# Altium project bt5.PrjPcb
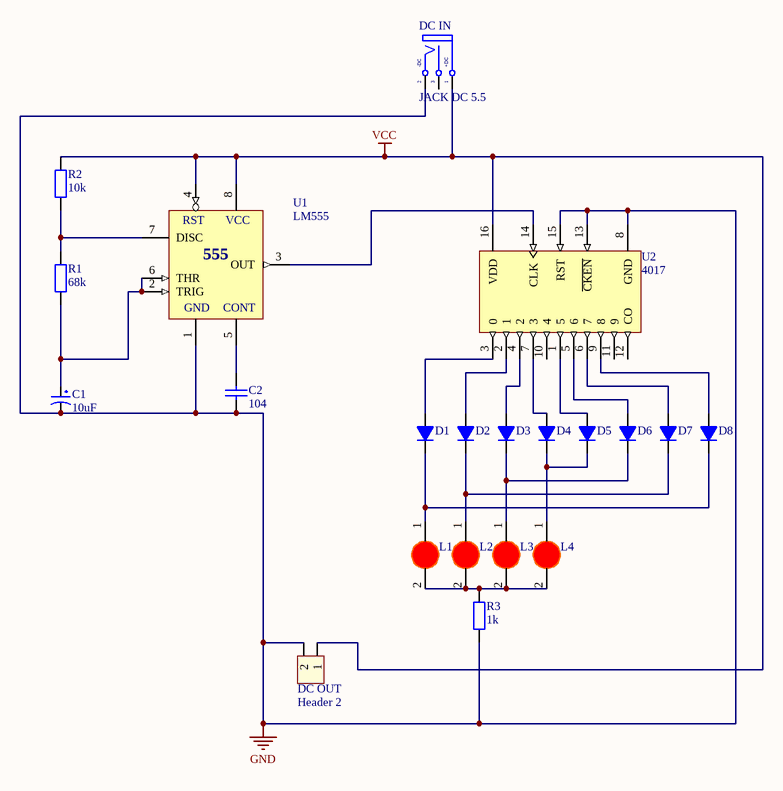
[diagram p0: schematic.SchDoc]
1 sheet, 21 parts. Net scope: global (net labels, ports and power ports of the same name join across sheets).
Board file: PCB.PcbDoc

## Sheet schematic.SchDoc
size A; SheetNumber: 1; SheetTotal: 1

### Parts
C1  10uF  [tu hoa 4mm]
C2  104  [tu gom]
D1  (no value)  [DIODE 1A]
D2  (no value)  [DIODE 1A]
D3  (no value)  [DIODE 1A]
D4  (no value)  [DIODE 1A]
D5  (no value)  [DIODE 1A]
D6  (no value)  [DIODE 1A]
D7  (no value)  [DIODE 1A]
D8  (no value)  [DIODE 1A]
DC_IN  JACK DC 5.5  [JACK DC 5.5]
DC_OUT  Header 2  [HED2]
L1  (no value)  [LED-3MM-RED]
L2  (no value)  [LED-3MM-RED]
L3  (no value)  [LED-3MM-RED]
L4  (no value)  [LED-3MM-RED]
R1  68k  [tro vach 1/4w]
R2  10k  [tro vach 1w]
R3  1k  [tro vach 1w]
U1  LM555  [DIP8/W0.3]
U2  4017  [DIP16/W0.3]

### Nets
GND: C1.2 C2.2 DC_IN.2(TN) DC_OUT.2 R3.1 U1.1(GND) U2.8(GND) U2.13(~{CKEN}) U2.15(RST)
VCC: DC_IN.1(T) DC_OUT.1 R2.2 U1.4(RST) U1.8(VCC) U2.16(VDD)
NetC1_1: C1.1 R1.1 U1.2(TRIG) U1.6(THR)
NetC2_1: C2.1 U1.5(CONT)
NetD1_1: D1.1(A) U2.3(0)
NetD1_2: D1.2(K) D8.2(K) L1.1(A)
NetD2_1: D2.1(A) U2.2(1)
NetD2_2: D2.2(K) D7.2(K) L2.1(A)
NetD3_1: D3.1(A) U2.4(2)
NetD3_2: D3.2(K) D6.2(K) L3.1(A)
NetD4_1: D4.1(A) U2.7(3)
NetD4_2: D4.2(K) D5.2(K) L4.1(A)
NetD5_1: D5.1(A) U2.1(5)
NetD6_1: D6.1(A) U2.5(6)
NetD7_1: D7.1(A) U2.6(7)
NetD8_1: D8.1(A) U2.9(8)
NetL1_2: L1.2(K) L2.2(K) L3.2(K) L4.2(K) R3.2
NetR1_2: R1.2 R2.1 U1.7(DISC)
NetU1_3: U1.3(OUT) U2.14(CLK)

Not connected (* = marked no-connect by the designer): DC_IN 3(S); U2 10(4) 11(9) 12(CO)

### Notes on the sheet
- (in symbol LM555) 555

### Library data of the parts
C1 = Tu Hoa 10uF 16V 4x7: Cắm; So_Chan: 2; Don_Vi: Con; Ten_Linh_Kien: Tụ Hóa 10uF 16V; Ma_Hang: MH006855; Chung_Loai: Cắm; Kieu_Chan: *
C2 = Tu gom 104 50V: Cắm; So_Chan: 2; Ten_Linh_Kien: Tụ gốm 104 100nF 50V; Don_Vi: Con; Ma_Hang: MH004761; Chung_Loai: Cắm; Kieu_Chan: *
D1-D8 = Diode 1N4007: Cắm; Ten_Linh_Kien: Diode 1N4007 1A (DIP); Don_Vi: Con; Ma_Hang: MH001063; Ghi Chu: *; Kieu_Chan: *; Chung_Loai: Cắm
DC_IN = JACK DC 5.5: Value: Jac DC
DC_OUT = Hed2: Header 2 (Green); Value: Header 2
L1-L4 = LED 3mm Do: Cắm; Don_Vi: Con; Ma_Hang: MH003892; Ten_Linh_Kien: Led 3MM Phủ Đỏ (10c); Ghi_Chu: *; Kieu_Chan: *; Chung_Loai: Cắm
R1 = Tro Vach 1/4W 5% 68k: Cắm; Don_Vi: Con; So_Chan: 2; Ten_Linh_Kien: Trở Vạch 1/4w 5% 68k; Ma_Hang: MH007332; Kieu_Chan: *; Chung_Loai: Cắm
R2 = Tro Vach 1W 5% 10k: Cắm; Don_Vi: Con; So_Chan: 2; Ten_Linh_Kien: Trở 5% 1w 10k; Ma_Hang: MH006391; Chung_Loai: Cắm; Kieu_Chan: *
R3 = Tro Vach 1W 5% 1k: Cắm; Don_Vi: Con; So_Chan: 2; Ten_Linh_Kien: Trở 5% 1w 1k; Ma_Hang: MH006397; Chung_Loai: Cắm; Kieu_Chan: *
U1 = LM555: Timer; Value: LM555
U2 = 4017: Decade Counter/Divider with 10 Decoded Outputs; Designed by: VanDungEvn; Value: CD4017